# EAGLE design NEO_R2_Schematic (EAGLE 9.6.2)
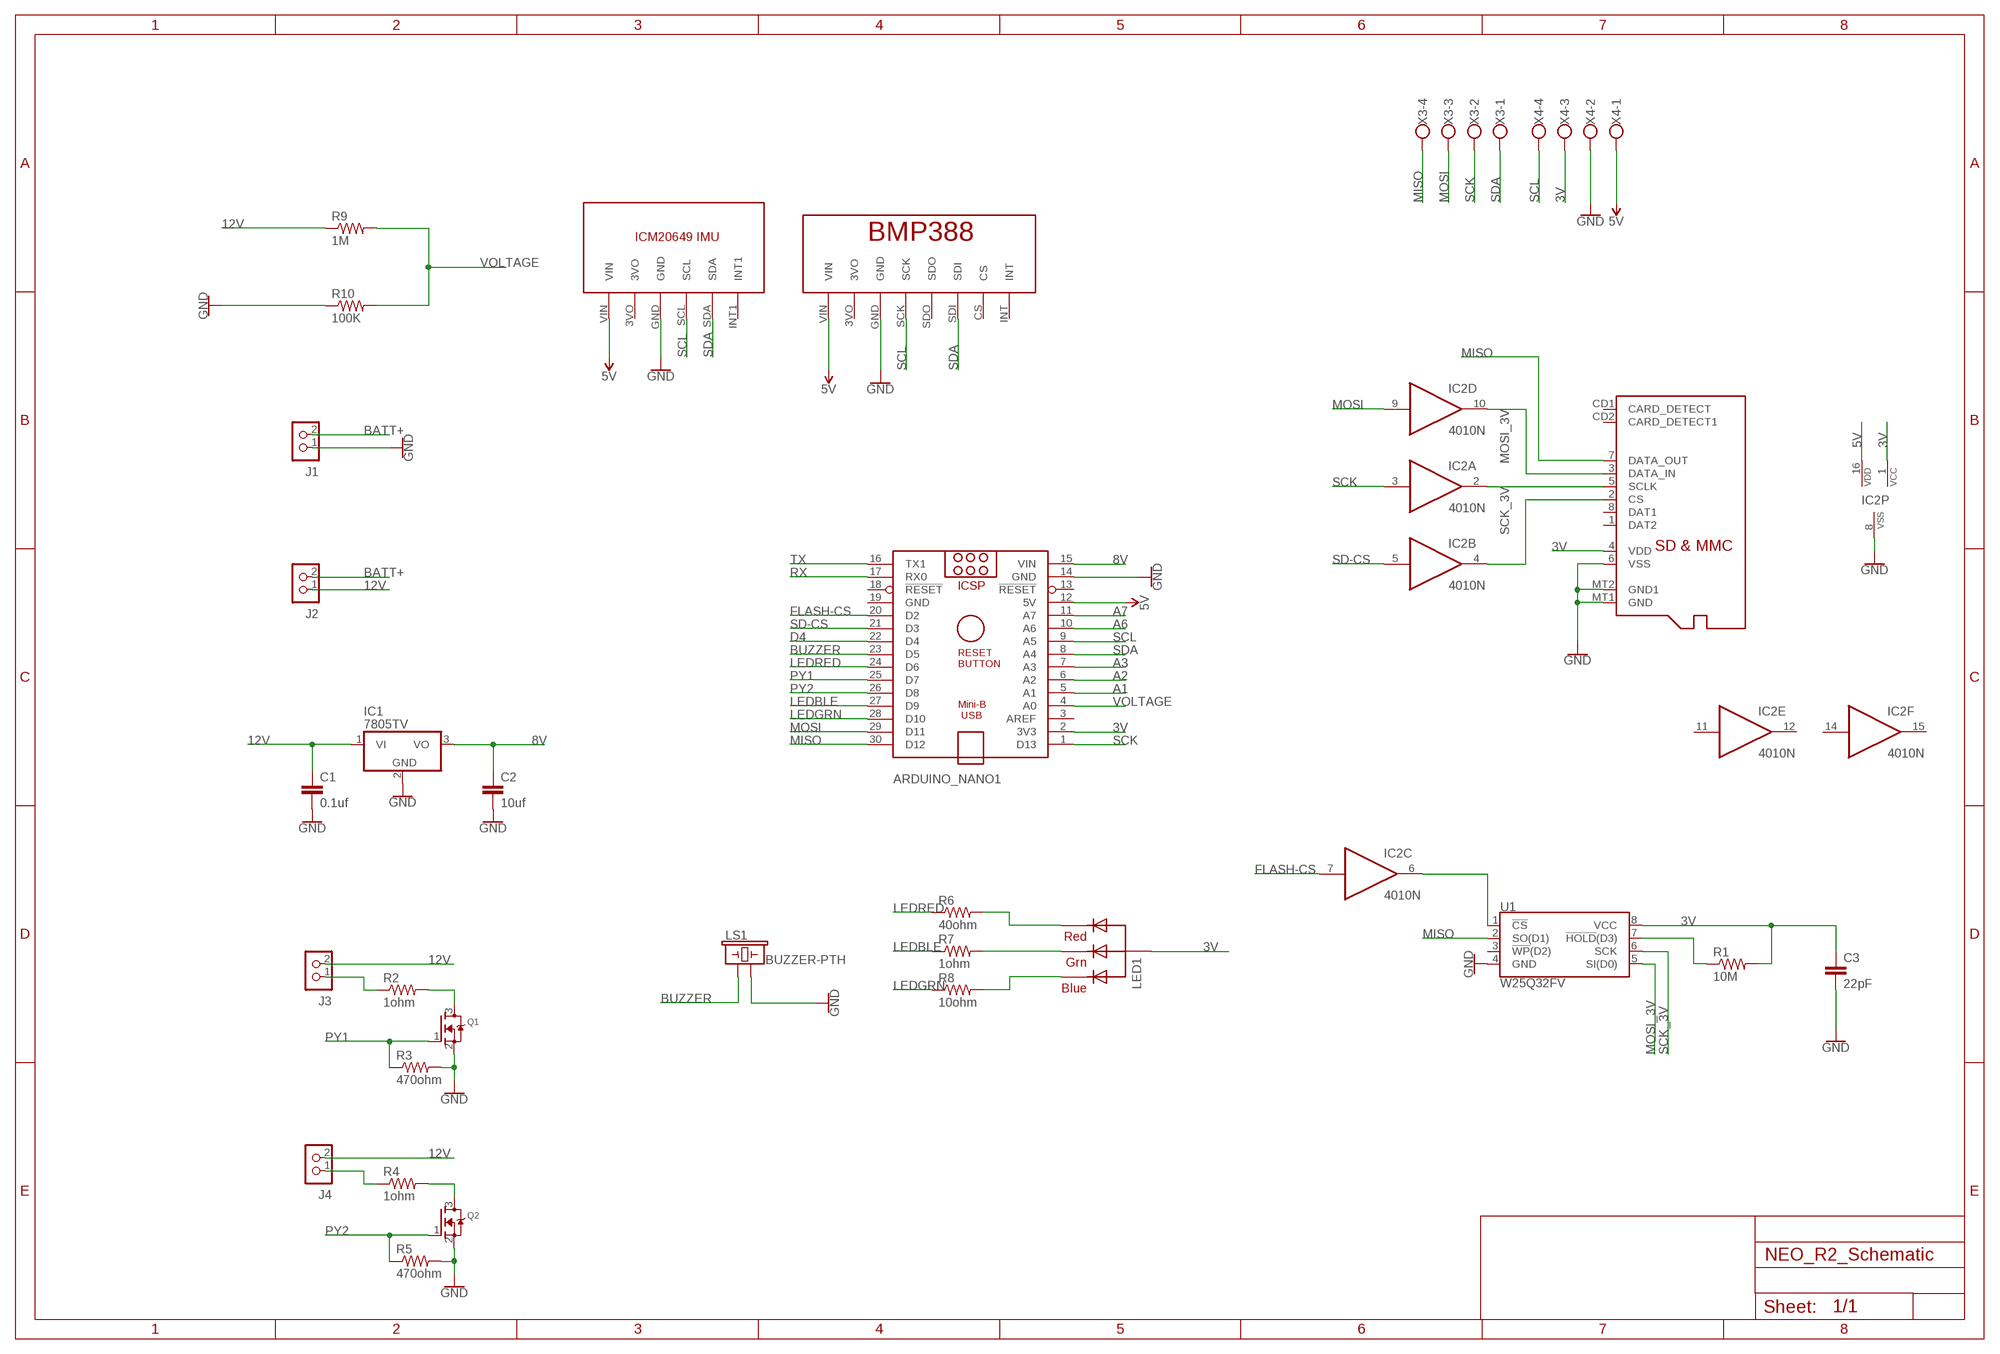
[diagram p0: schematic, sheet 1]

## Parts
ARDUINO_NANO1  ARDUINO_NANO  [ARDUINO_NANO]
C1  0.1uf  C-EU025-024X044  [C025-024X044]
C2  10uf  C-EU025-024X044  [C025-024X044]
C3  22pF  C-EU025-024X044  [C025-024X044]
IC1  7805TV  [TO220V]
IC2  4010N  [DIL16]
J1  CON_TERMINAL_BLOCK_02-5MM  [TERMINAL_BLOCK_2P_5]
J2  CON_TERMINAL_BLOCK_02-5MM  [TERMINAL_BLOCK_2P_5]
J3  CON_TERMINAL_BLOCK_02-5MM  [TERMINAL_BLOCK_2P_5]
J4  CON_TERMINAL_BLOCK_02-5MM  [TERMINAL_BLOCK_2P_5]
LED1  RGBLED_CA-5MM  [LED5MMRGB]
LS1  BUZZER-PTH  [BUZZER-12MM]
Q1  MOSFET-NREFLOW  [SOT23]
Q2  MOSFET-NREFLOW  [SOT23]
R1  10M  R-US_0207/7  [0207/7]
R2  1ohm  R-US_0207/7  [0207/7]
R3  470ohm  R-US_0207/7  [0207/7]
R4  1ohm  R-US_0207/7  [0207/7]
R5  470ohm  R-US_0207/7  [0207/7]
R6  40ohm  R-US_0207/7  [0207/7]
R7  1ohm  R-US_0207/7  [0207/7]
R8  10ohm  R-US_0207/7  [0207/7]
R9  1M  R-US_0207/7  [0207/7]
R10  100K  R-US_0207/7  [0207/7]
U1  W25Q32FV  W25Q32FVSS  [SOIC-8]
U$1  MICROSD  [MICROSD]
U$3  BMP388  [BMP388]
U$4  ICM20649  [ICM20649]
X3  W237-4  [W237-4]
X4  W237-4  [W237-4]

## Nets
3V: ARDUINO_NANO1.2(3V3) C3.1 IC2.1(P:VCC) LED1.2(VCC) R1.2 U1.8(VCC) U$1.4(VDD) X4.3
5V: ARDUINO_NANO1.12(5V) IC2.16(P:VDD) U$3.VIN U$4.VIN X4.1
8V: ARDUINO_NANO1.15(VIN) C2.1 IC1.3(VO)
12V: C1.1 IC1.1(VI) J2.1 J3.2 J4.2 R9.1
A1: ARDUINO_NANO1.5(A1)
A2: ARDUINO_NANO1.6(A2)
A3: ARDUINO_NANO1.7(A3)
A6: ARDUINO_NANO1.10(A6)
A7: ARDUINO_NANO1.11(A7)
BATT+: J1.2 J2.2
BUZZER: ARDUINO_NANO1.23(D5) LS1.+
D4: ARDUINO_NANO1.22(D4)
FLASH-CS: ARDUINO_NANO1.20(D2) IC2.7(C:I)
GND: ARDUINO_NANO1.14(GND) C1.2 C2.2 C3.2 IC1.2(GND) IC2.8(P:VSS) J1.1 LS1.- Q1.2(S) Q2.2(S) R3.2 R5.2 R10.1 U1.4(GND) U$1.6(VSS) U$1.MT1(GND) U$1.MT2(GND1) U$3.GND U$4.GND X4.2
LEDBLE: ARDUINO_NANO1.27(D9) R7.1
LEDGRN: ARDUINO_NANO1.28(D10) R8.1
LEDRED: ARDUINO_NANO1.24(D6) R6.1
MISO: ARDUINO_NANO1.30(D12) U1.2(SO(D1)) U$1.7(DATA_OUT) X3.4
MOSI: ARDUINO_NANO1.29(D11) IC2.9(D:I) X3.3
MOSI_3V: IC2.10(D:O) U1.5(SI(D0)) U$1.3(DATA_IN)
N$1: R1.1 U1.7(!HOLD!(D3))
N$2: J3.1 R2.1
N$3: Q1.3(D) R2.2
N$4: J4.1 R4.1
N$5: Q2.3(D) R4.2
N$8: IC2.4(B:O) U$1.2(CS)
N$9: LED1.1(RED) R6.2
N$10: LED1.3(GREEN) R7.2
N$11: LED1.4(BLUE) R8.2
N$12: IC2.6(C:O) U1.1(!CS!)
PY1: ARDUINO_NANO1.25(D7) Q1.1(G) R3.1
PY2: ARDUINO_NANO1.26(D8) Q2.1(G) R5.1
RX: ARDUINO_NANO1.17(RX0)
SCK: ARDUINO_NANO1.1(D13) IC2.3(A:I) X3.2
SCK_3V: IC2.2(A:O) U1.6(SCK) U$1.5(SCLK)
SCL: ARDUINO_NANO1.9(A5) U$3.SCK U$4.SCL X4.4
SD-CS: ARDUINO_NANO1.21(D3) IC2.5(B:I)
SDA: ARDUINO_NANO1.8(A4) U$3.SDI U$4.SDA X3.1
TX: ARDUINO_NANO1.16(TX1)
VOLTAGE: ARDUINO_NANO1.4(A0) R9.2 R10.2
Unconnected: ARDUINO_NANO1.3(AREF) ARDUINO_NANO1.13(!RESET) ARDUINO_NANO1.18(!RESET) IC2.11(E:I) IC2.12(E:O) IC2.14(F:I) IC2.15(F:O) U1.3(!WP!(D2)) U$1.1(DAT2) U$1.8(DAT1) U$1.CD1(CARD_DETECT) U$1.CD2(CARD_DETECT1) U$3.3VO U$3.CS U$3.INT U$3.SDO U$4.3VO U$4.INT1

## Power pins joined to a net without a drawn wire
GND: ARDUINO_NANO1.19(GND)

## Library data of the parts
ARDUINO_NANO1 = ArduinoNanoV30:ARDUINO_NANO: Arduino Nano V3.0 Overview: The Arduino Nano is a small, complete, and breadboard-friendly board based on the ATmega328 (Arduino Nano 3.x) or ATmega168 (Arduino Nano 2.x). It has more or less the same functionality of the Arduino Duemilanove, but in a different package. It lacks only a DC power jack, and works with a Mini-B USB cable instead of a standard one. The Nano was designed and is being produced by Gravitech. Specifications: Microcontroller Atmel ATmega168 or ATmega328 Operating Voltage (logic level) 5 V Input Voltage (recommended) 7-12 V Input Voltage (limits) 6-20 V Digital I/O Pins 14 (of which 6 provide PWM output) Analog Input Pins 8 DC Current per I/O Pin 40 mA Flash Memory 16 KB (ATmega168) or 32 KB (ATmega328) of which 2 KB used by bootloader SRAM 1 KB (ATmega168) or 2 KB (ATmega328) EEPROM 512 bytes (ATmega168) or 1 KB (ATmega328) Clock Speed 16 MHz Dimensions 0.73" x 1.70" Length 45 mm Width 18 mm Weigth 5 g Power: The Arduino Nano can be powered via the Mini-B USB connection, 6-20V unregulated external power supply (pin 30), or 5V regulated external power supply (pin 27). The power source is automatically selected to the highest voltage source. Memory: The ATmega168 has 16 KB of flash memory for storing code (of which 2 KB is used for the bootloader); the ATmega328 has 32 KB, (also with 2 KB used for the bootloader). The ATmega168 has 1 KB of SRAM and 512 bytes of EEPROM (which can be read and written with the EEPROM library); the ATmega328 has 2 KB of SRAM and 1 KB of EEPROM. Input and Output: Each of the 14 digital pins on the Nano can be used as an input or output, using pinMode(), digitalWrite(), and digitalRead() functions. They operate at 5 volts. Each pin can provide or receive a maximum of 40 mA and has an internal pull-up resistor (disconnected by default) of 20-50 kOhms. In addition, some pins have specialized functions. Visit Arduino - ArduinoBoardNano <https://www.arduino.cc/en/Main/ArduinoBoardNano>
C1-C3 = rcl:C-EU: CAPACITOR, European symbol; SPICEPREFIX: C
IC1 = linear:78*: Positive VOLTAGE REGULATOR Source: http://cache.national.com/ds/LM/LM78L05.pdf http://www.fairchildsemi.com/ds/LM/LM7805.pdf
IC2 = 40xx:4010: Hex BUFFER, Non-inverting Source: www.fairchildsemi.com CD4010.pdf © 2000 Fairchild Semiconductor Corporation DS005945
J1-J4 = dp_devices:CON_TERMINAL_BLOCK_02: 2 poles wire to board terminal block
LED1 = adafruit:RGBLED_CA: RGB LED, common-anode 5MM Staggered pins 5mm Piranha package http://www.ladyada.net/library/pcb/eaglelibrary.html
LS1 = SparkFun-Electromechanical:BUZZER: Buzzer Small round buzzers that operate around the audible 2kHz range. You can use these as speakers to create simple music or user interfaces. Variant Overview: PTH - Mini Speaker - PC Mount 12mm 2.048kHz <https://www.sparkfun.com/products/7950> PTH_KIT - Mini Speaker - PC Mount 12mm 2.048kHz <https://www.sparkfun.com/products/7950> KIT simplifies soldering by adding stop mask to one side of the pads. PTH_NO_SILK - Mini Speaker - PC Mount 12mm 2.048kHz <https://www.sparkfun.com/products/7950> No silkscreen indicator of buzzer outline. PTH_KIT_NO_SILK - Mini Speaker - PC Mount 12mm 2.048kHz <https://www.sparkfun.com/products/7950> KIT package w/o silkscreen SMD - Buzzer Audio Magnetic (CCV-084B16) SMD buzzer used on, e.g. the LilyPad Buzzer <https://www.sparkfun.com/products/8463> and RFID USB Reader <https://www.sparkfun.com/products/9963>. SMD_KIT - Buzzer Audio Magnetic (CCV-084B16) SMD Buzzer with elongated pins to make soldering easier. Used on the SparkFun Simon Says - Surface Mount Soldering Kit <https://www.sparkfun.com/products/10935>. SMD-SQUARE - Buzzer Audio Magnetic (COMP-15701) SMT square buzzer with one chamfered corner.; PROD_ID: COMP-08253; SF_SKU: COM-07950
Q1 Q2 = adafruit:MOSFET-N: N-Channel Mosfet 2N7002E - 60V 260mA SOT23 [Digikey: 2N7002ET1GOSTR-ND] - REEL BSH103 - 30V 850mA SOT23 [Digikey: 568-5013-1-ND]
R1-R10 = adafruit:R-US_: RESISTOR, American symbol
U1 = SparkFun-IC-Memory:W25Q32FV: W25Q32FV 32Mb (4MB) Serial Flash Memory The W25Q32FV support the standard Serial Peripheral Interface (SPI), Dual/Quad I/O SPI as well as 2-clocks instruction cycle Quad Peripheral Interface (QPI). 104MHz, SPI, 8-SOIC-EIAJ Datasheet <http://www.winbond.com/resource-files/w25q32fv%20revh%20091613.pdf> SparkFun Products SparkFun Blynk Board - ESP8266 <https://www.sparkfun.com/products/13794> (WRL-13794); PROD_ID: IC-13229
U$1 = adafruit:MICROSD: Micro-SD / Transflash card holder with SPI pinout For the 3M # 2908-05WB-MG and/or 4UCON #19656 push-push type
U$3 = BMP388:BMP388
U$4 = ICM20649:ICM20649
X3 X4 = con-wago-500:W237-4: WAGO SCREW CLAMP; OC_FARNELL: unknown; OC_NEWARK: unknown

## Board
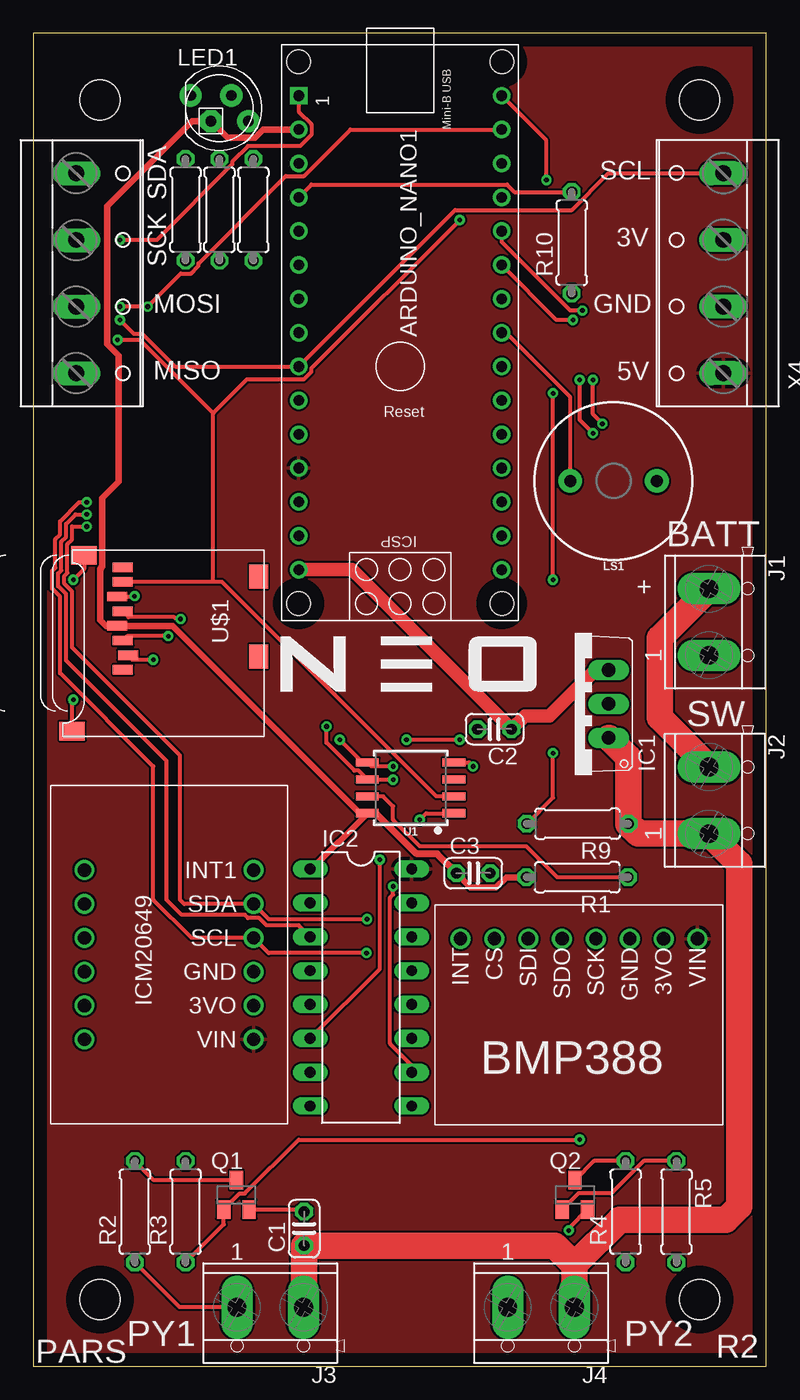
[diagram p1: board, top side]
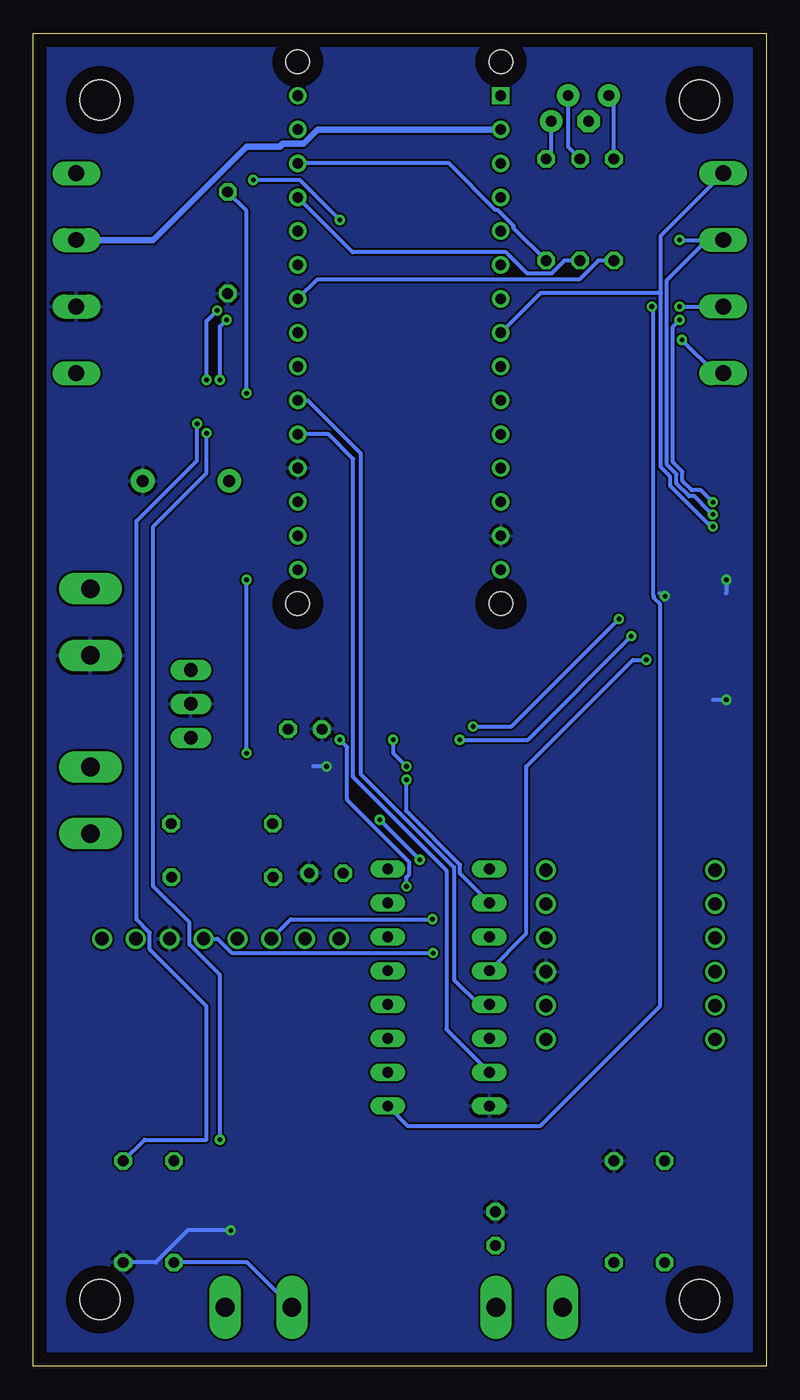
[diagram p2: board, bottom side, seen from below]

Size 55 x 100 mm. Coordinates in mm from the lower left corner, seen from the top.
Outline: 0,0 55,0 55,100 0,100 0,0
Copper layers (1*16): Top 0.035mm / dielectric 1.5mm / Bottom 0.035mm
Design rules "default": minimum track width 6mil, minimum drill 0.35mm, track to track 6mil, track to pad 6mil, pad to pad 6mil, via to via 6mil, smd to smd 6mil, copper to edge 40mil, drill to drill 6mil, minimum pad ring 10mil, minimum via ring 8mil, stop-mask expansion 4mil, vias tented up to drill 0mil, thermal gap 10mil
Holes 3 mm at 5,5 50,5 50,95 5,95

### Footprints (pad centres in the part's own frame; a part is rotated, then mirrored left to right if it is on the bottom)
ARDUINO_NANO = drill 0.8 square: 1 -20.32,-7.62 | drill 0.8: 2 -17.78,-7.62; 3 -15.24,-7.62; 4 -12.7,-7.62; 5 -10.16,-7.62; 6 -7.62,-7.62; 7 -5.08,-7.62; 8 -2.54,-7.62; 9 0,-7.62; 10 2.54,-7.62; 11 5.08,-7.62; 12 7.62,-7.62; 13 10.16,-7.62; 14 12.7,-7.62; 15 15.24,-7.62; 16 15.24,7.62; 17 12.7,7.62; 18 10.16,7.62; 19 7.62,7.62; 20 5.08,7.62; 21 2.54,7.62; 22 0,7.62; 23 -2.54,7.62; 24 -5.08,7.62; 25 -7.62,7.62; 26 -10.16,7.62; 27 -12.7,7.62; 28 -15.24,7.62; 29 -17.78,7.62; 30 -20.32,7.62 | hole 1.778: -22.86,-7.62; -22.86,7.62; 17.78,7.62; 17.78,-7.62
C025-024X044 = drill 0.813 octagon: 1 -1.27,0; 2 1.27,0
TO220V = drill 1.016 long: 1 -2.54,-2.54; 2 0,-2.54; 3 2.54,-2.54
DIL16 = drill 0.813 long: 1 -8.89,-3.81; 2 -6.35,-3.81; 3 -3.81,-3.81; 4 -1.27,-3.81; 5 1.27,-3.81; 6 3.81,-3.81; 7 6.35,-3.81; 8 8.89,-3.81; 9 8.89,3.81; 10 6.35,3.81; 11 3.81,3.81; 12 1.27,3.81; 13 -1.27,3.81; 14 -3.81,3.81; 15 -6.35,3.81; 16 -8.89,3.81
TERMINAL_BLOCK_2P_5 = drill 1.4 pad 2.38 long: 1 2.5,-0.45; 2 -2.5,-0.45
LED5MMRGB = drill 0.8 pad 1.676: 1 -2.159,0.968; 3 0.889,0.968; 4 2.159,-0.968 | drill 0.8 pad 1.676 octagon: 2 -0.635,-0.968
BUZZER-12MM = drill 0.9 pad 1.778: + 3.25,0; - -3.25,0
SOT23 = smd 1 x 1.4: 1 -0.95,-1.1; 2 0.95,-1.1; 3 0,1.1
0207/7 = drill 0.813 octagon: 1 -3.81,0; 2 3.81,0
SOIC-8 = smd 0.61 x 1.702: 1 -1.905,-3.251; 2 -0.635,-3.251; 3 0.635,-3.251; 4 1.905,-3.251; 5 1.905,3.251; 6 0.635,3.251; 7 -0.635,3.251; 8 -1.905,3.251
MICROSD = smd 0.7 x 1.5: 1 9,-10.64; 2 7.9,-10.24; 3 6.8,-10.64; 4 5.7,-11.04; 5 4.6,-10.64; 6 3.5,-11.04; 7 2.4,-10.64; 8 1.3,-10.64 | smd 1.8 x 1.4: CD1 2,-0.44; CD2 8,-0.44 | smd 1.4 x 1.9: MT1 0.4,-13.54; MT2 13.6,-14.44
BMP388 = drill 0.991: 3VO 4.445,2.54; CS 17.145,2.54; GND 6.985,2.54; INT 19.685,2.54; SCK 9.525,2.54; SDI 14.605,2.54; SDO 12.065,2.54; VIN 1.905,2.54
ICM20649 = drill 0.991: 3VO 8.89,2.54; GND 11.43,2.54; INT1 19.05,2.54; P$7 6.35,15.24; P$8 8.89,15.24; P$9 11.43,15.24; P$10 13.97,15.24; P$11 16.51,15.24; P$12 19.05,15.24; SCL 13.97,2.54; SDA 16.51,2.54; VIN 6.35,2.54
W237-4 = drill 1.194 long: 1 -7.5,-1.27; 2 -2.5,-1.27; 3 2.5,-1.27; 4 7.5,-1.27

### Placement (x,y rotation side)
ARDUINO_NANO1  27.53,75 270 top
C1  20.32,10.32 90 top
C2  34.61,47.79 180 top
C3  33.02,36.99 0 top
IC1  40.64,49.69 90 top
IC2  24.59,28.4 270 top
J1  51.16,55.83 270 top
J2  51.16,42.45 270 top
J3  17.78,3.97 180 top
J4  38.1,3.97 180 top
LED1  13.97,94.38 0 top
LS1  43.54,66.42 180 top
Q1  15.24,12.86 0 top
Q2  40.64,12.86 0 top
R1  40.82,36.69 180 top
R2  7.62,11.59 90 top
R3  11.43,11.59 90 top
R4  44.45,11.59 90 top
R5  48.26,11.59 270 top
R6  11.43,86.76 90 top
R7  13.97,86.76 90 top
R8  16.51,86.76 90 top
R9  40.84,40.7 180 top
R10  40.41,84.29 90 top
U1  28.32,43.39 90 top
U$1  17.35,61.25 270 top
U$3  51.75,34.61 180 top
U$4  19.08,18.16 90 top
X3  4.5,82 270 top
X4  50.5,82 90 top

### Tracks (layer width: path | path; a pad name or v marks a point on that pad's centre or on a via)
3V
  Top 0.5: IC2.1 20.88,37.3 U1.8 24.51,41.49 10.45,55.55 U$1.4 5.45,55.55 5,56 5,59.82 5.16,59.98 5.16,65.15 6.39,66.38 6.39,75.83 5.54,76.68 5.54,87.04 11.91,93.41 LED1.2 14.58,92.17 16.64,92.17 17.25,92.78 ARDUINO_NANO1.2 | 31.45,37.3 C3.1 32.81,35.93 34.73,35.93 35.49,36.69 R1.2
  Top 0.508: C3.1 30.3,38.44 28.77,38.44 25.73,41.49 U1.8
  Bottom 0.5: ARDUINO_NANO1.2 33.66,92.78 34.72,91.72 36.28,91.72 36.5,91.5 39,91.5 46,84.5 X4.3
5V
  pour Top: -2.54,102 58.42,102 58.42,-2.38 -2.54,-2.38
8V
  Top 1: IC1.3 42.18,52.23 38.74,48.79 36.88,48.79 C2.1 23.91,59.76 ARDUINO_NANO1.15
12V
  Top 2: IC1.1 44.65,45.68 R9.1 45.4,39.95 J2.1 52.98,37.67 52.98,12 51.98,11 44,11 40.6,7.6 | J4.2 40.6,7.6 | 40.6,7.6 39.15,9.05 C1.1 20.32,4.46 J3.2
BATT+
  Top 2: J1.2 47,54.62 47,48.66 J2.2
BUZZER
  Top 0.3: LS1.+ 40.29,72.71 35.46,77.54 ARDUINO_NANO1.23
FLASH-CS
  Bottom 0.3: IC2.7 24,25.28 24,37.19 31,44.19 31,68.07 32.85,69.92 ARDUINO_NANO1.20
GND  (via drill 0.35)
  Top 0.3: Q1.2 20.15,11.76 C1.2 | Q2.2 40.18,10.35 v40.18,10.18 | U$1.MT1 3.81,59.81 v3,59 | U$1.MT2 2.91,49.91 v3,50 | U$1.6 7.57,57.75 v7.59,57.77 | U1.4 32.7,45.3 v33,45
  Bottom 0.3: v3,50 4,50 | v3,59 3,58 | v7.59,57.77 7.77,57.77 8,58 | v33,45 34,45 | R5.2 45.81,7.78 43.41,10.18 v40.18,10.18
  pour Bottom: -2.54,102 57.15,102 57.15,-2.38 -2.54,-2.38
LEDBLE
  Bottom 0.3: R7.1 15.15,82.95 16.11,81.99 17.93,81.99 19.52,83.58 31.03,83.58 ARDUINO_NANO1.27
LEDGRN
  Bottom 0.3: R8.1 18.96,85.4 18.96,85.56 20.14,86.74 20.31,86.74 23.81,90.24 ARDUINO_NANO1.28
LEDRED
  Bottom 0.3: R6.1 12.61,82.95 14.02,81.53 33.7,81.53 ARDUINO_NANO1.24
MISO  (via drill 0.35)
  Top 0.3: U1.2 30.24,42.76 14.15,58.85 13.5,58.85 | 13.5,58.85 U$1.7 | 13.5,58.85 13.5,71.5 | v6.32,77 8,77 13.5,71.5 | 13.5,71.5 16.04,74.04 20.31,74.04 20.87,74.6 20.87,74.87 v32,86 | v38.5,89 38.5,91.97 ARDUINO_NANO1.30
  Bottom 0.3: v6.32,77 3.82,74.5 X3.4 | v32,86 35,89 v38.5,89
MOSI  (via drill 0.35)
  Top 0.3: v6.5,79.5 v8.59,79.5 11.07,81.99 11.83,81.99 12.39,82.55 12.39,82.73 18.94,89.28 20.31,89.28 23.81,92.78 ARDUINO_NANO1.29
  Bottom 0.3: 8.45,57.66 8.39,57.61 | 8.39,57.61 8,57.21 8,27 17,18 26.88,18 IC2.9 | 8.39,57.61 8.39,57.75 8.45,57.81 8.45,79.37 v8.59,79.5 | v6.5,79.5 X3.3
MOSI_3V  (via drill 0.35)
  Top 0.3: v23,47 24.7,45.3 U1.5 25.37,45 v27,45 | v10.13,54.77 7.03,54.77 U$1.3 | IC2.10 28.4,22.57 26.77,24.2 26.77,35.15 27,35.38 v27,36 | v32,47 v28,47
  Bottom 0.3: v23,47 17.9,47 v10.13,54.77 | v27,36 27,36.67 26.77,36.9 26.77,37.81 31.45,42.49 31.45,46.45 v32,47 | v28,47 28,46 v27,45
N$1
  Top 0.3: R1.1 39.31,36.69 37,39 29,39 27,41 27,42 26.24,42.76 U1.7
N$2
  Top 0.3: J3.1 10.98,4.42 R2.1
N$3
  Top 0.3: Q1.3 9.04,13.96 7.62,15.38 R2.2
N$4
  Bottom 0.3: J4.1 38.96,7.78 R4.1
N$5
  Top 0.3: R4.2 42.08,15.4 Q2.3
N$8  (via drill 0.35)
  Top 0.3: v9,53 7.46,53 U$1.2
  Bottom 0.3: IC2.4 18,32.45 18,45 10,53 v9,53
N$9
  Bottom 0.3: LED1.1 11.48,95.02 11.43,94.97 R6.2
N$10
  Bottom 0.3: R7.2 14.86,91.46 LED1.3
N$11
  Bottom 0.3: R8.2 16.13,90.95 LED1.4
N$12  (via drill 0.35)
  Top 0.3: IC2.6 26,29.82 v26,38 | v29,41 29.49,41.49 U1.1
  Bottom 0.3: v26,38 v29,41
PY1  (via drill 0.35)
  Top 0.3: R3.1 14.29,10.64 Q1.1 15.49,12.96 15.87,12.96 19.91,17 v41,17 | v42,70 41,71 v41,74 | v40.5,78.5 39.27,78.5 ARDUINO_NANO1.25
  Bottom 0.3: v41,17 41,29.36 43.28,31.64 43.28,33.28 46,36 46,63 42,67 v42,70 | v41,74 41,78 v40.5,78.5
PY2  (via drill 0.35)
  Top 0.3: Q2.1 40.89,12.96 43.37,12.96 45.81,15.4 R5.1 | v42.71,70.71 42,71.41 v42,74 | v41.21,79.21 | v41.21,79.21 40.29,79.21 35.15,84.35 ARDUINO_NANO1.26
  Bottom 0.3: R5.1 46.66,17 42,17 42,27 46.25,31.25 46.25,32.51 47.25,33.51 47.25,63.41 42.71,67.96 v42.71,70.71 | v42,74 42,78.41 v41.21,79.21
SCK  (via drill 0.35)
  Top 0.3: IC2.3 19.91,33.08 17.49,33.08 16.95,33.62 16.1,33.62 15.86,33.86 11.14,33.86 10,35 10,45.41 2.45,52.96 2.45,57.94 1.87,58.53 1.87,59.47 2.1,59.71 2.1,61.86 2.45,62.21 2.45,63.19 3.17,63.91 v4,63.91 | v6.5,84.5 9.26,84.5 14.93,90.17 14.93,90.35 16.11,91.53 20.02,91.53 20.87,92.38 20.87,93.18 19.91,94.13 ARDUINO_NANO1.1
  Bottom 0.3: v4,63.91 4.23,64.14 4.28,64.14 5.41,65.26 5.78,65.26 6.74,66.23 6.74,66.92 7.45,67.63 7.45,81.49 4.44,84.5 X3.2 v6.5,84.5
SCK_3V  (via drill 0.35)
  Top 0.3: v22,48 22,46.78 24.09,44.69 24.41,44.69 U1.6 25.1,44 v27,44 | v11.04,56.06 10.72,56.06 10.58,56.2 7.16,56.2 U$1.5
  Bottom 0.3: v22,48 19.1,48 v11.04,56.06 | IC2.2 22.98,36.95 22.98,37.62 27,41.64 v27,44
SCL  (via drill 0.35)
  Top 0.3: v25,31 17.67,31 U$4.SCL 11.87,32.13 9,35 9,45 2,52 2,57.76 1.42,58.34 1.42,59.66 1.65,59.89 1.65,62.05 2,62.4 2,63.38 3.44,64.82 v4,64.82 | v6.5,78.5 7.55,77.45 8.19,77.45 10.64,75 ARDUINO_NANO1.9 31.66,86.74 40.41,86.74 43.17,89.5 X4.4
  Bottom 0.3: U$3.SCK 41.17,32.07 40.12,31.02 25.02,31.02 v25,31 | v4,64.82 4.9,65.72 5.59,65.72 6.29,66.42 6.29,67.11 7,67.82 7,78 v6.5,78.5
SD-CS
  Bottom 0.3: IC2.5 21.56,27.13 23.43,29 23.43,37.43 30.43,44.43 30.43,68.5 34.39,72.46 ARDUINO_NANO1.21
SDA  (via drill 0.35)
  Top 0.3: v25.04,33.54 17.68,33.54 U$4.SDA 11.32,34.67 11,35 11,45.83 2.9,53.92 2.9,58.13 2.32,58.72 2.32,59.28 2.56,59.52 2.56,61.67 2.9,62.02 2.9,63 v4,63
  Bottom 0.3: U$3.SDI 35.68,33.54 v25.04,33.54 | v4,63 4.23,63.23 4.38,63.23 7.2,66.04 7.2,66.73 7.91,67.44 7.91,80.5 | X3.1 7.91,84.83 7.91,80.5 | 7.91,80.5 16.95,80.5 ARDUINO_NANO1.8
VOLTAGE  (via drill 0.35)
  Top 0.3: R9.2 39,42.66 v39,46 | v39,59 v39,73 | R10.2 36.11,88.1 35.55,88.66 20.87,88.66 ARDUINO_NANO1.4
  Bottom 0.3: v39,46 v39,59 | v39,73 39,86.69 R10.2

### Text on the board
tNames: SCL | SDA | 3V | SCK | MOSI | GND | MISO | 5V | BATT | + | SW | PY1 | PY2 | R2 | PARS